# EAGLE design ASD2611 (EAGLE 6.3)
DATABASE: ./../../../../../Components/TinyCircuits_Part_Database.txt
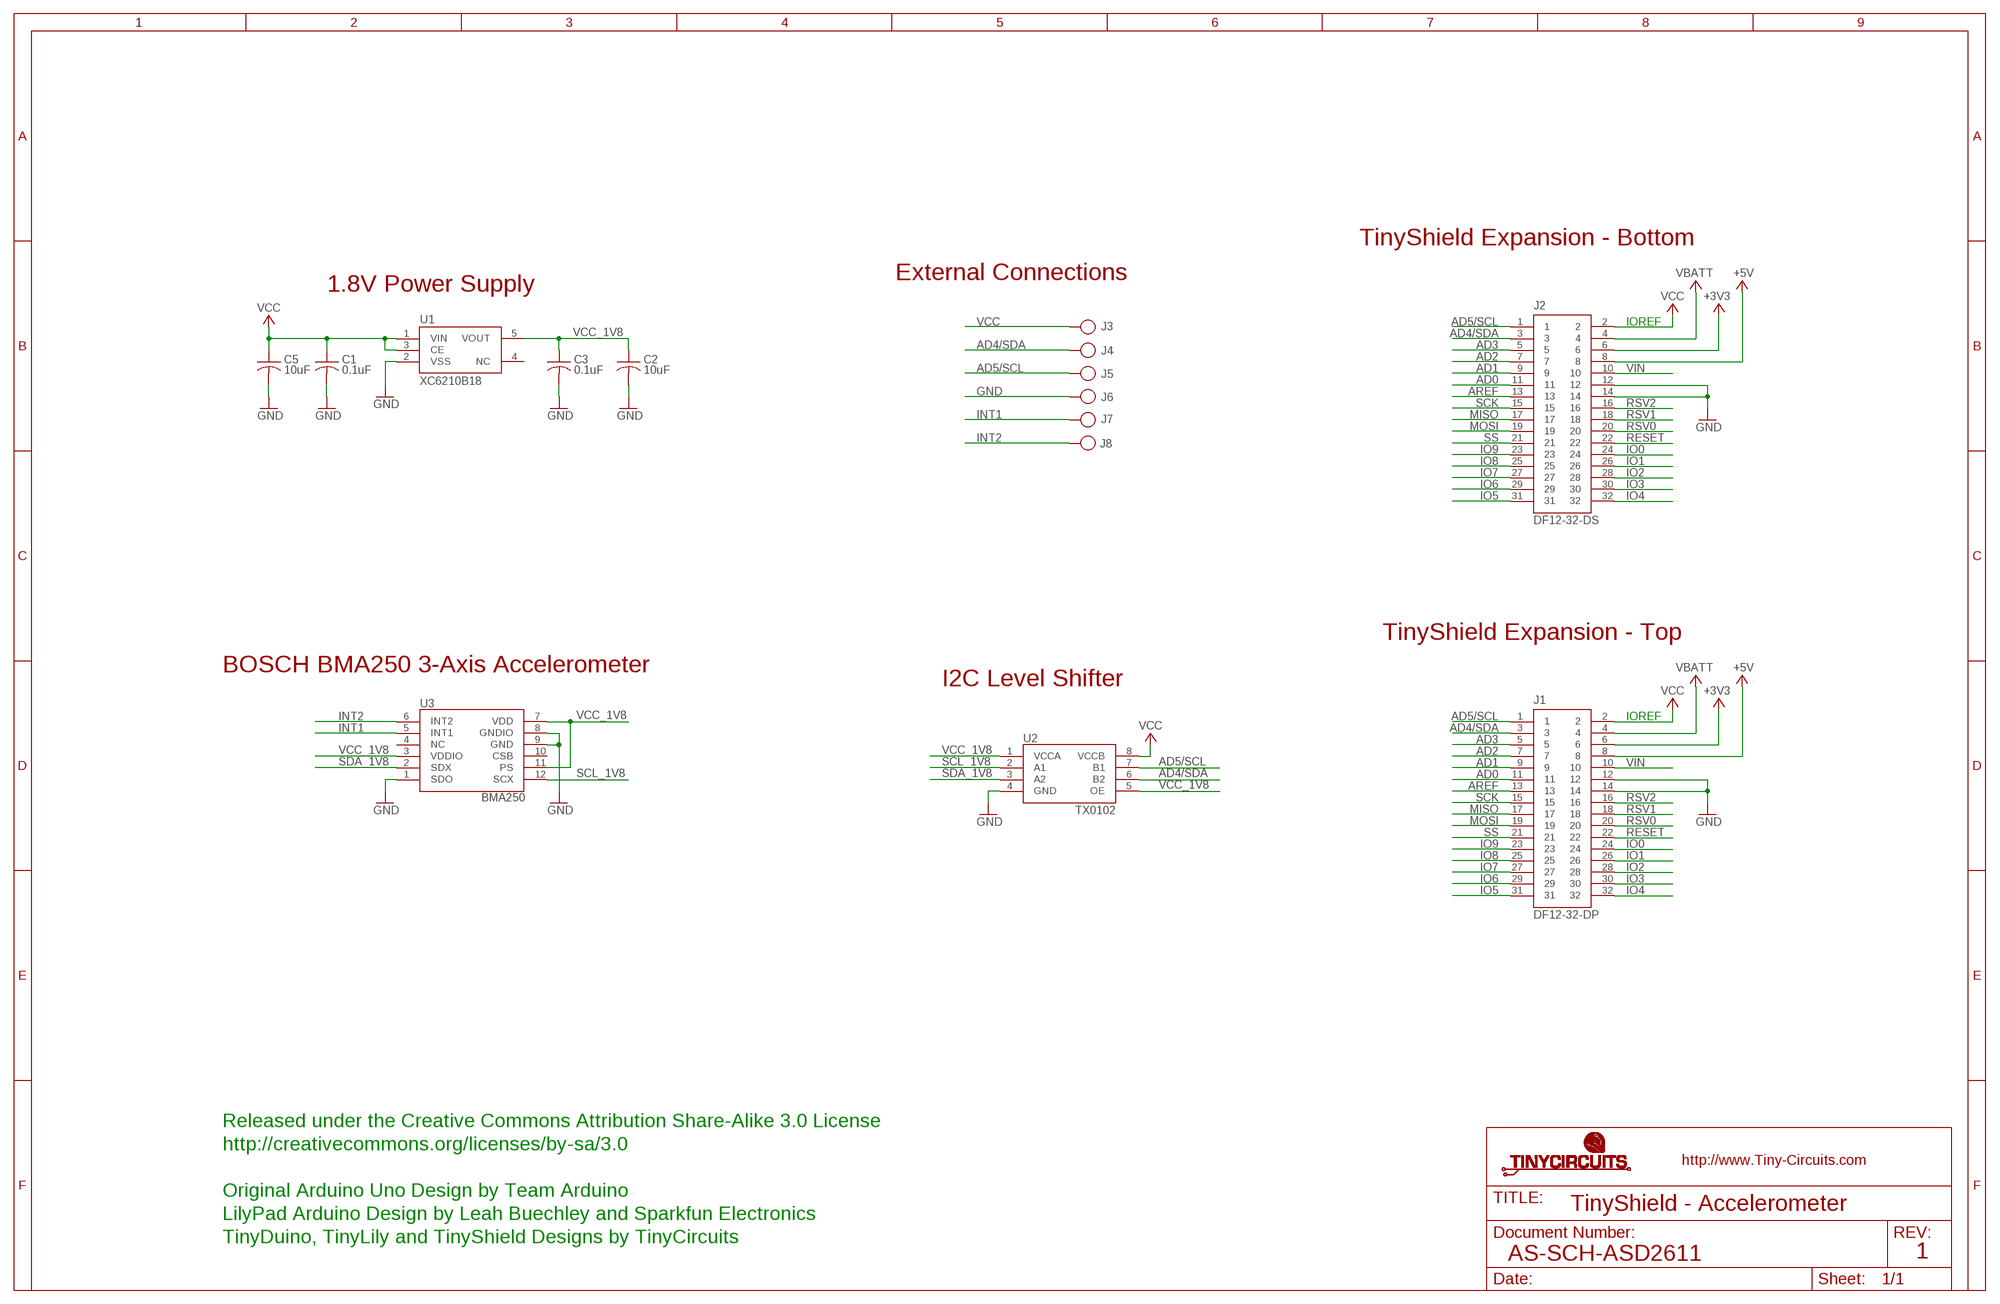
[diagram p0: schematic, sheet 1]

## Parts
C1  0.1uF  AS-ITM-00008  [C0402]
C2  10uF  AS-ITM-00045  [C0805]
C3  0.1uF  AS-ITM-00008  [C0402]
C5  10uF  AS-ITM-00045  [C0805]
J1  DF12-32-DP  AS-ITM-00015  [DF12-32-DP]
J2  DF12-32-DS  AS-ITM-00012  [DF12-32-DS]
J3  PIN_1X.1"  [1X.1"]
J4  PIN_1X.1"  [1X.1"]
J5  PIN_1X.1"  [1X.1"]
J6  PIN_1X.1"  [1X.1"]
J7  PIN_1X.1"  [1X.1"]
J8  PIN_1X.1"  [1X.1"]
U1  XC6210B18  AS-ITM-00075  [SOT-25]
U2  TX0102  AS-ITM-00073  [DQE(R-PX2SON-N8)]
U3  BMA250  AS-ITM-00070  [3-AXIS_ACCELEROMETER]

## Nets
+3V3: J1.6 J2.6
+5V: J1.8 J2.8
AD0: J1.11 J2.11
AD1: J1.9 J2.9
AD2: J1.7 J2.7
AD3: J1.5 J2.5
AD4/SDA: J1.3 J2.3 J4.1 U2.6(B2)
AD5/SCL: J1.1 J2.1 J5.1 U2.7(B1)
AREF: J1.13 J2.13
GND: C1.2 C2.2 C3.2 C5.2 J1.12 J1.14 J2.12 J2.14 J6.1 U1.2(VSS) U2.4(GND) U3.1(SDO) U3.8(GNDIO) U3.9(GND)
INT1: J7.1 U3.5(INT1)
INT2: J8.1 U3.6(INT2)
IO0: J1.24 J2.24
IO1: J1.26 J2.26
IO2: J1.28 J2.28
IO3: J1.30 J2.30
IO4: J1.32 J2.32
IO5: J1.31 J2.31
IO6: J1.29 J2.29
IO7: J1.27 J2.27
IO8: J1.25 J2.25
IO9: J1.23 J2.23
MISO: J1.17 J2.17
MOSI: J1.19 J2.19
RESET: J1.22 J2.22
RSV0: J1.20 J2.20
RSV1: J1.18 J2.18
RSV2: J1.16 J2.16
SCK: J1.15 J2.15
SCL_1V8: U2.2(A1) U3.12(SCX)
SDA_1V8: U2.3(A2) U3.2(SDX)
SS: J1.21 J2.21
VBATT: J1.4 J2.4
VCC: C1.1 C5.1 J1.2 J2.2 J3.1 U1.1(VIN) U1.3(CE) U2.8(VCCB)
VCC_1V8: C2.1 C3.1 U1.5(VOUT) U2.1(VCCA) U2.5(OE) U3.3(VDDIO) U3.7(VDD) U3.11(PS)
VIN: J1.10 J2.10
Unconnected: U1.4(NC) U3.4(NC) U3.10(CSB)

## Notes on the sheet
- TinyShield Expansion - Bottom
- External Connections
- 1.8V Power Supply
- IOREF
- TinyShield Expansion - Top
- BOSCH BMA250 3-Axis Accelerometer
- I2C Level Shifter
- IOREF
- Released under the Creative Commons Attribution Share-Alike 3.0 License
- http://creativecommons.org/licenses/by-sa/3.0
- Original Arduino Uno Design by Team Arduino
- TinyShield - Accelerometer
- LilyPad Arduino Design by Leah Buechley and Sparkfun Electronics
- TinyDuino, TinyLily and TinyShield Designs by TinyCircuits
- AS-SCH-ASD2611 | 1

## Library data of the parts
C1 C3 = tinycircuits:AS-ITM-00008: CAP CER 0.1UF 16V 10% X5R 0402; PARTNO: AS-ITM-00008
C2 C5 = tinycircuits:AS-ITM-00045: CAP CER 16UF 16V 20% X5R 0805; PARTNO: AS-ITM-00045
J1 = tinycircuits:AS-ITM-00015: CONN HEADER 32POS 3MM SMD 0.5MM; PARTNO: AS-ITM-00015
J2 = tinycircuits:AS-ITM-00012: CONN RECEPT 32POS 3MM SMD 0.5MM; PARTNO: AS-ITM-00012
J3-J8 = tinycircuits:PIN_1X.1": 1 Pin 0.100" Header
U1 = tinycircuits:AS-ITM-00075: IC REG LDO 1.8V .7A SOT-25; PARTNO: AS-ITM-00075
U2 = tinycircuits:AS-ITM-00073: TI 2-Bit Bidirectional Voltage-Level Translator; PARTNO: AS-ITM-00073; VALUE: TXS0102
U3 = tinycircuits:AS-ITM-00070: 3-AXIS ACCELEROMOETER; PARTNO: AS-ITM-00070

## Board
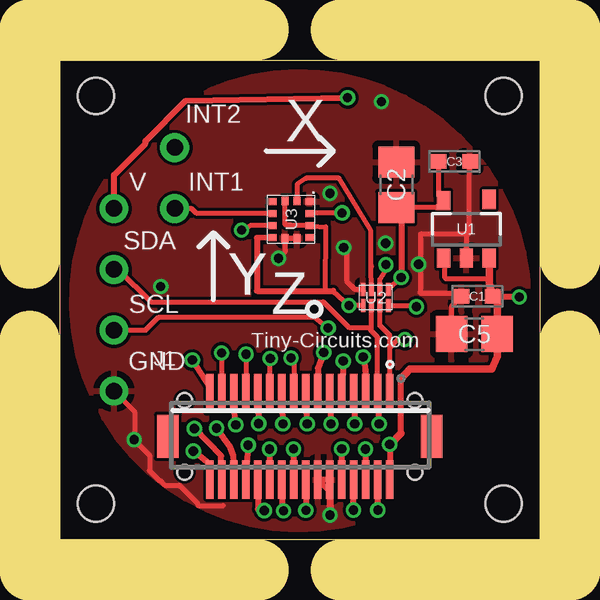
[diagram p1: board, top side]
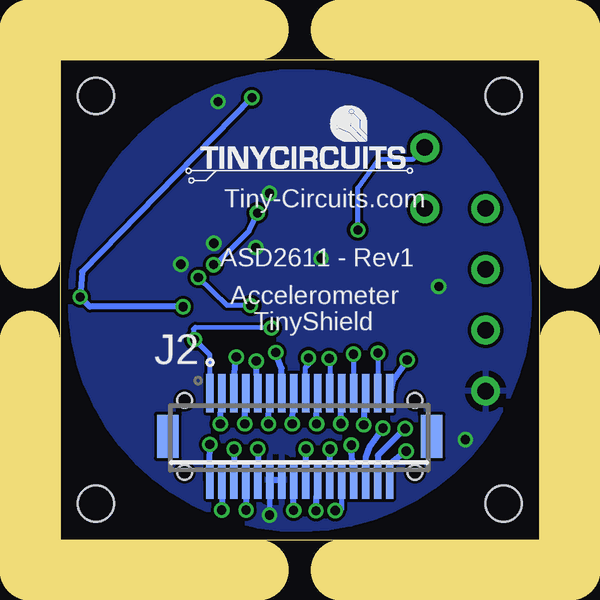
[diagram p2: board, bottom side, seen from below]

Size 20 x 20 mm. Coordinates in mm from the lower left corner, seen from the top.
Outline: 0,20 20,20 20,0 0,0 0,20
Copper layers (1*16): Top 0.035mm / dielectric 1.5mm / Bottom 0.035mm
Design rules "default *": minimum track width 5mil, minimum drill 15mil, track to track 5mil, track to pad 5mil, pad to pad 5mil, via to via 6mil, smd to smd 5mil, copper to edge 6mil, drill to drill 8mil, minimum pad ring 10mil, minimum via ring 5mil, stop-mask expansion 4mil, vias tented up to drill 25mil, thermal gap 10mil
Holes 1.5 mm at 1.5,18.5 18.5,18.5 18.5,1.5 1.5,1.5
Milling: 8 lines

### Footprints (pad centres in the part's own frame; a part is rotated, then mirrored left to right if it is on the bottom)
C0402 = smd 0.65 x 0.6: 1 -0.65,0; 2 0.65,0
C0805 = smd 1.3 x 1.5: 1 -0.95,0; 2 0.95,0
DF12-32-DP = smd 0.3 x 1.6: 1 -3.75,-1.8; 2 -3.75,1.8; 3 -3.25,-1.8; 4 -3.25,1.8; 5 -2.75,-1.8; 6 -2.75,1.8; 7 -2.25,-1.8; 8 -2.25,1.8; 9 -1.75,-1.8; 10 -1.75,1.8; 11 -1.25,-1.8; 12 -1.25,1.8; 13 -0.75,-1.8; 14 -0.75,1.8; 15 -0.25,-1.8; 16 -0.25,1.8; 17 0.25,-1.8; 18 0.25,1.8; 19 0.75,-1.8; 20 0.75,1.8; 21 1.25,-1.8; 22 1.25,1.8; 23 1.75,-1.8; 24 1.75,1.8; 25 2.25,-1.8; 26 2.25,1.8; 27 2.75,-1.8; 28 2.75,1.8; 29 3.25,-1.8; 30 3.25,1.8; 31 3.75,-1.8; 32 3.75,1.8 | smd 0.9 x 1.8: F1 -5.5,0; F2 5.5,0 | hole 0.6: -4.8,1.5; 4.8,1.5
DF12-32-DS = smd 0.3 x 1.6: 1 -3.75,1.8; 2 -3.75,-1.8; 3 -3.25,1.8; 4 -3.25,-1.8; 5 -2.75,1.8; 6 -2.75,-1.8; 7 -2.25,1.8; 8 -2.25,-1.8; 9 -1.75,1.8; 10 -1.75,-1.8; 11 -1.25,1.8; 12 -1.25,-1.8; 13 -0.75,1.8; 14 -0.75,-1.8; 15 -0.25,1.8; 16 -0.25,-1.8; 17 0.25,1.8; 18 0.25,-1.8; 19 0.75,1.8; 20 0.75,-1.8; 21 1.25,1.8; 22 1.25,-1.8; 23 1.75,1.8; 24 1.75,-1.8; 25 2.25,1.8; 26 2.25,-1.8; 27 2.75,1.8; 28 2.75,-1.8; 29 3.25,1.8; 30 3.25,-1.8; 31 3.75,1.8; 32 3.75,-1.8 | smd 0.9 x 1.8: F1 -5.5,0; F2 5.5,0 | hole 0.6: -4.8,1.5; 4.8,1.5
1X.1" = drill 0.7 pad 1.016: 1 0,0
SOT-25 = smd 0.55 x 0.8: 1 -0.95,-1.2; 2 0,-1.2; 3 0.95,-1.2; 4 0.95,1.25; 5 -0.95,1.2
DQE(R-PX2SON-N8) = smd 0.2 x 0.53: 1 -0.525,-0.335; 2 -0.175,-0.335; 3 0.175,-0.335; 4 0.525,-0.335; 5 0.525,0.335; 6 0.175,0.335; 7 -0.175,0.335; 8 -0.525,0.335
3-AXIS_ACCELEROMETER = smd 0.3 x 0.35: 1 -0.75,0.775; 4 -0.75,-0.775; 5 -0.25,-0.775; 6 0.25,-0.775; 7 0.75,-0.775; 10 0.75,0.775; 11 0.25,0.775; 12 -0.25,0.775 | smd 0.35 x 0.3: 2 -0.775,0.25; 3 -0.775,-0.25; 8 0.775,-0.25; 9 0.775,0.25

### Placement (x,y rotation side)
C1  17.4,10.14 180 top
C2  14.03,14.79 90 top
C3  16.45,15.76 0 top
C5  17.28,8.57 180 top
J1  10,4.3 180 top
J2  10,4.3 0 bottom
J3  2.25,13.81 0 top
J4  2.25,11.27 0 top
J5  2.25,8.73 0 top
J6  2.25,6.19 0 top
J7  4.79,13.81 0 top
J8  4.79,16.35 0 top
U1  16.95,12.93 0 top
U2  13.17,10.1 180 top
U3  9.64,13.34 270 top
U$1  [DOCFIELD-TINYCIRCUITS-PCB]  33.91,-10 0 top  (outside the outline)

### Tracks (layer width: path | path; a pad name or v marks a point on that pad's centre or on a via)
+3V3  (via drill 0.38)
  Top 0.254: J2.6 v12.75,3.77 v12.74,3.77
  Bottom 0.254: v12.74,3.77 12.74,2.51 J2.6
+5V  (via drill 0.38)
  Top 0.254: v12.24,1.23 J2.8
  Bottom 0.254: J2.8 12.25,1.21 v12.24,1.23
AD0  (via drill 0.38)
  Top 0.254: v11.3,4.83 11.31,5.05 J2.11
  Bottom 0.254: J2.11 11.28,5.79 v11.3,4.83
AD1  (via drill 0.38)
  Top 0.254: J2.9 11.79,6.27 v11.81,7.44
  Bottom 0.254: v11.81,7.44 11.78,6.22 J2.9
AD2  (via drill 0.38)
  Top 0.254: v12.29,4.83 12.31,5.05 J2.7
  Bottom 0.254: J2.7 12.27,5.86 v12.29,4.83
AD3  (via drill 0.38)
  Top 0.254: J2.5 12.73,7.04 v12.65,7.61
  Bottom 0.254: v12.65,7.61 12.78,6.3 J2.5
AD4/SDA  (via drill 0.38)
  Top 0.203: J2.3 13.24,8.44 12.96,8.72 12.99,8.85 | 12.99,8.85 12.99,9.73 U2.6 | J4.1 2.44,11.27 3.79,9.91 10.98,9.91 12.05,8.85 12.99,8.85
  Top 0.254: v13.31,4.83 13.31,5 J2.3
  Bottom 0.254: J2.3 13.28,5.86 v13.31,4.83
AD5/SCL  (via drill 0.38)
  Top 0.203: J2.1 13.75,8.01 | 13.75,8.01 13.75,8.52 13.34,8.92 U2.7 | J5.1 3.57,8.73 4.12,9.28 10.62,9.28 v11.18,8.82 | v14.38,8.34 14.08,8.34 13.75,8.01
  Bottom 0.203: v11.18,8.82 14.36,8.85 14.43,8.77 14.43,8.39 v14.38,8.34 13.75,7.7 J2.1
AREF  (via drill 0.38)
  Top 0.254: J2.13 10.75,7.15 v11,7.8
  Bottom 0.254: v11,7.8 10.76,7.14 J2.13
GND  (via drill 0.38)
  Top 0.203: 17.05,12.76 15.07,12.76 15.04,12.73 15.04,10.45 15.04,10.26 16.62,10.27 C1.2 16.33,9.73 C5.2 | 17.05,12.76 16.95,12.65 U1.2 | C3.2 17.05,15.72 17.05,12.76 | J2.12 v11.26,1.02 | J6.1 3.11,5.33 3.11,4.26 3.22,4.15 3.22,4.09 | 11.3,1.95 11.3,1.14 11.29,1.13 11.29,1.09 | v3.09,4.16 3.73,3.52 3.73,2.87 4.13,2.47 4.17,2.47 4.37,2.27 4.98,2.27 5.74,1.51 5.74,1.44 5.77,1.41 6.82,1.41 | J2.14 11.27,1.97 11.27,1.93 11.22,1.87 11.22,0.86 11.28,0.92 11.28,1.03 11.3,1.01 11.37,1.01 | U2.4 12.29,10.43 11.97,10.75 11.97,12.04 v11.83,12.18 | U3.1 10.43,14.09 10.45,14.08 | U3.9 U3.8 9.39,12.01 v9.11,11.73
  Top 0.254: J2.12 J2.14
  Bottom 0.203: v11.26,1.02 11.25,1.21 J2.12
  Bottom 0.254: J2.12 J2.14
  other vias: 4.21,10.56 13.41,18.27 13.59,12.35 14.96,11.48 11.26,14.43
  pour Top: 18.49,5.61 arc180 1.54,14.32 arc180
  pour Bottom: 18.49,5.61 arc180 1.5,14.34 arc180
INT1
  Top 0.203: U3.5 5.7,13.59 5.49,13.8 J7.1
INT2  (via drill 0.38)
  Top 0.203: U3.6 7.95,13.09 v7.58,12.91
  Bottom 0.203: v7.58,12.91 7.58,14.66 6.69,15.86 5.28,15.86 J8.1
IO0  (via drill 0.38)
  Top 0.254: J2.24 8.25,1.26 v8.52,1.21
  Bottom 0.203: v8.52,1.21 8.48,1.27 8.25,1.27 J2.24
  Bottom 0.254: J2.24
IO1  (via drill 0.38)
  Top 0.254: v7.85,3.94 J2.26
  Bottom 0.254: 7.85,3.66 J2.26 v7.85,3.94
IO2  (via drill 0.38)
  Top 0.254: v6.53,4.64 7.07,3.89 7.22,3.49 7.29,2.61 7.26,2.51 J2.28
  Bottom 0.254: J2.28 7.24,3.43 7.07,3.88 v6.53,4.64
IO3  (via drill 0.38)
  Top 0.254: J2.30 6.73,3.49 v5.61,4.63
  Bottom 0.254: v5.61,4.63 6.75,3.51 6.77,2.53 J2.30
IO4  (via drill 0.38)
  Top 0.254: J2.32 6.25,3.14 v5.56,3.69
  Bottom 0.254: v5.56,3.69 5.61,3.65 6.21,3.18 6.21,3.14 6.26,3.1 J2.32
IO5  (via drill 0.38)
  Top 0.254: v5.52,7.49 6.23,6.38 J2.31
  Bottom 0.254: J2.31 6.11,6.64 v5.52,7.49
IO6  (via drill 0.38)
  Top 0.203: J2.29 6.75,7.81 6.74,7.82 v6.74,7.79
  Top 0.254: J2.29
  Bottom 0.203: v6.74,7.79 6.74,6.11 J2.29
IO7  (via drill 0.38)
  Top 0.254: v7.33,4.78 7.31,4.9 J2.27
  Bottom 0.254: J2.27 7.29,5.76 v7.33,4.78
IO8  (via drill 0.38)
  Top 0.203: v7.76,7.73 7.76,6.11 J2.25
  Bottom 0.203: J2.25 v7.75,7.72 v7.76,7.73
IO9  (via drill 0.38)
  Top 0.254: v8.29,4.83 8.31,4.98 J2.23
  Bottom 0.254: J2.23 8.28,5.59 v8.29,4.83
MISO  (via drill 0.38)
  Top 0.203: v9.63,7.58 9.75,7.46 J2.17
  Bottom 0.203: J2.17 9.76,6.11 9.76,7.17 9.63,7.3 v9.63,7.58
MOSI  (via drill 0.38)
  Top 0.254: v9.3,4.83 9.31,4.95 J2.19
  Bottom 0.254: J2.19 9.27,5.76 v9.3,4.83
RESET  (via drill 0.38)
  Top 0.254: v8.74,3.77 J2.22
  Bottom 0.254: J2.22 8.75,3.69 v8.74,3.77
RSV0  (via drill 0.38)
  Top 0.254: J2.20 9.25,1.2 v9.32,1.2
  Bottom 0.254: v9.32,1.2 J2.20
RSV1  (via drill 0.38)
  Top 0.254: v9.74,3.77 9.74,2.51 J2.18
  Bottom 0.254: J2.18 9.75,3.72 v9.74,3.77
RSV2  (via drill 0.38)
  Top 0.254: J2.16 10.25,1.16 v10.25,1.22
  Bottom 0.254: v10.25,1.22 J2.16
SCK  (via drill 0.38)
  Top 0.254: v10.31,4.83 10.31,4.98 J2.15
  Bottom 0.254: J2.15 10.29,5.66 v10.31,4.83
SCL_1V8  (via drill 0.38)
  Top 0.203: U2.2 13.34,10.85 13.6,11.23 v13.6,11.46 | v11.77,13.62 10.44,13.62 U3.12
  Bottom 0.203: v13.6,11.46 13.32,11.67 12.1,12.89 12.1,12.91 v11.77,13.62
SDA_1V8
  Top 0.203: U2.3 12.97,11.41 12.96,11.44 | 12.96,11.44 12.99,11.36 | 12.96,11.44 12.96,12.89 11.64,15.07 10.27,15.07 9.89,14.82 U3.2
SS  (via drill 0.38)
  Top 0.203: J2.21 8.77,6.12 v8.77,7.55
  Bottom 0.203: v8.77,7.55 8.75,7.53 J2.21
VBATT  (via drill 0.38)
  Top 0.254: v13.25,1.23 J2.4
  Bottom 0.254: J2.4 13.25,1.24 v13.25,1.23
VCC  (via drill 0.38)
  Top 0.203: 18.23,10.32 C1.1 18.07,10.12 | 13.77,2.52 J2.2 13.73,2.67 v13.75,3.97 | U1.1 16.04,11.7 16.04,10.93 16.09,10.88 17.9,10.88 | 14.84,9.76 v14.87,9.71 14.82,9.76 U2.8
  Top 0.254: 13.77,2.52 13.77,3.97 | 14.21,4.43 14.21,6.69 | v19.16,10.12 18.07,10.12 | J3.1 2.25,15.2 3.56,16.52 3.56,16.62 5.24,18.3 v12,18.42
  Top 0.305: C1.1 17.9,10.65 17.9,10.88 U1.3 | 18.23,10.32 C5.1 18.23,7.64 18.02,7.12 14.59,7.12 14.21,6.69 | 13.77,3.97 14.21,4.43
  Bottom 0.203: J2.2 13.77,2.45
  Bottom 0.254: 13.77,2.45 v13.75,3.97 | v14.87,9.71 18.75,9.71 v19.16,10.12 19.08,11.16 v12,18.42
VCC_1V8  (via drill 0.38)
  Top 0.203: C3.1 15.8,14.33 U1.5 15.7,13.84 C2.1 14.25,13.45 | U2.5 v12.05,9.76 11.39,10.37 | v14.23,10.93 14.19,10.9 U2.1 | U3.11 9.45,13.09 9.38,13.16 | 9.38,13.16 U3.3 | 9.38,13.16 11.08,13.04 11.06,10.37
  Top 0.254: U3.7 8.21,12.58 8.21,10.37 11.06,10.37 11.39,10.37 | 14.25,13.45 v14.23,10.93
  Bottom 0.203: v12.05,9.76 13.04,9.76 v14.23,10.93
VIN  (via drill 0.38)
  Top 0.254: J2.10 v11.76,3.78 v11.75,3.78
  Bottom 0.254: v11.75,3.78 J2.10

### Text on the board
tPlace: INT2 | X | V | INT1 | SDA | Y | SCL | Z | Tiny-Circuits.com | GND
bPlace: Tiny-Circuits.com | ASD2611 - Rev1 | Accelerometer | TinyShield
Document: FABRICATION DRAWING | NOTES: | 1. PRINTED CIRCUIT BOARD MADE FROM NEMA GRADE FR-4 EPOXY LAMINATE | WITH 1 OUNCE COPPER PLATING AND .024 THICKNESS. | 2. ALL DIMENSIONS ARE GIVEN IN INCHES. | 3. CIRCUIT PATHS ARE FOR REFERENCE ONLY. | 4. HOLE SIZES SHOWN ARE FINISHED DIAMETERS AFTER PLATING. | 5. BOARD PLATED USING REFLOW OR SIMILAR METHOD. | 6. BOARD TO HAVE BLUE SOLDER MASK ON PLATED SURFACES USING WET FILM | 7. SILKSCREEN BOARD USING WHITE INK. | SR100 OR SR1010 EPOXY. EQUIVALENT WET OR DRY FILM MAY BE USED. | 8. THE FOLLOWING INFORMATION APPLIES TO THIS BOARD: | * 2 COPPER LAYERS | * .024 BOARD THICKNESS | * REQUIRES TOP SIDE SILKSCREEN | Released under the Creative Commons Attribution Share-Alike 3.0 License | http://creativecommons.org/licenses/by-sa/3.0 | Original Arduino Uno Design by Team Arduino | LilyPad Arduino Design by Leah Buechley and Sparkfun Electronics | TinyDuino, TinyLily and TinyShield Designs by TinyCircuits | TinyShield - Accelerometer | AS-PCB-ASD2611 | 1